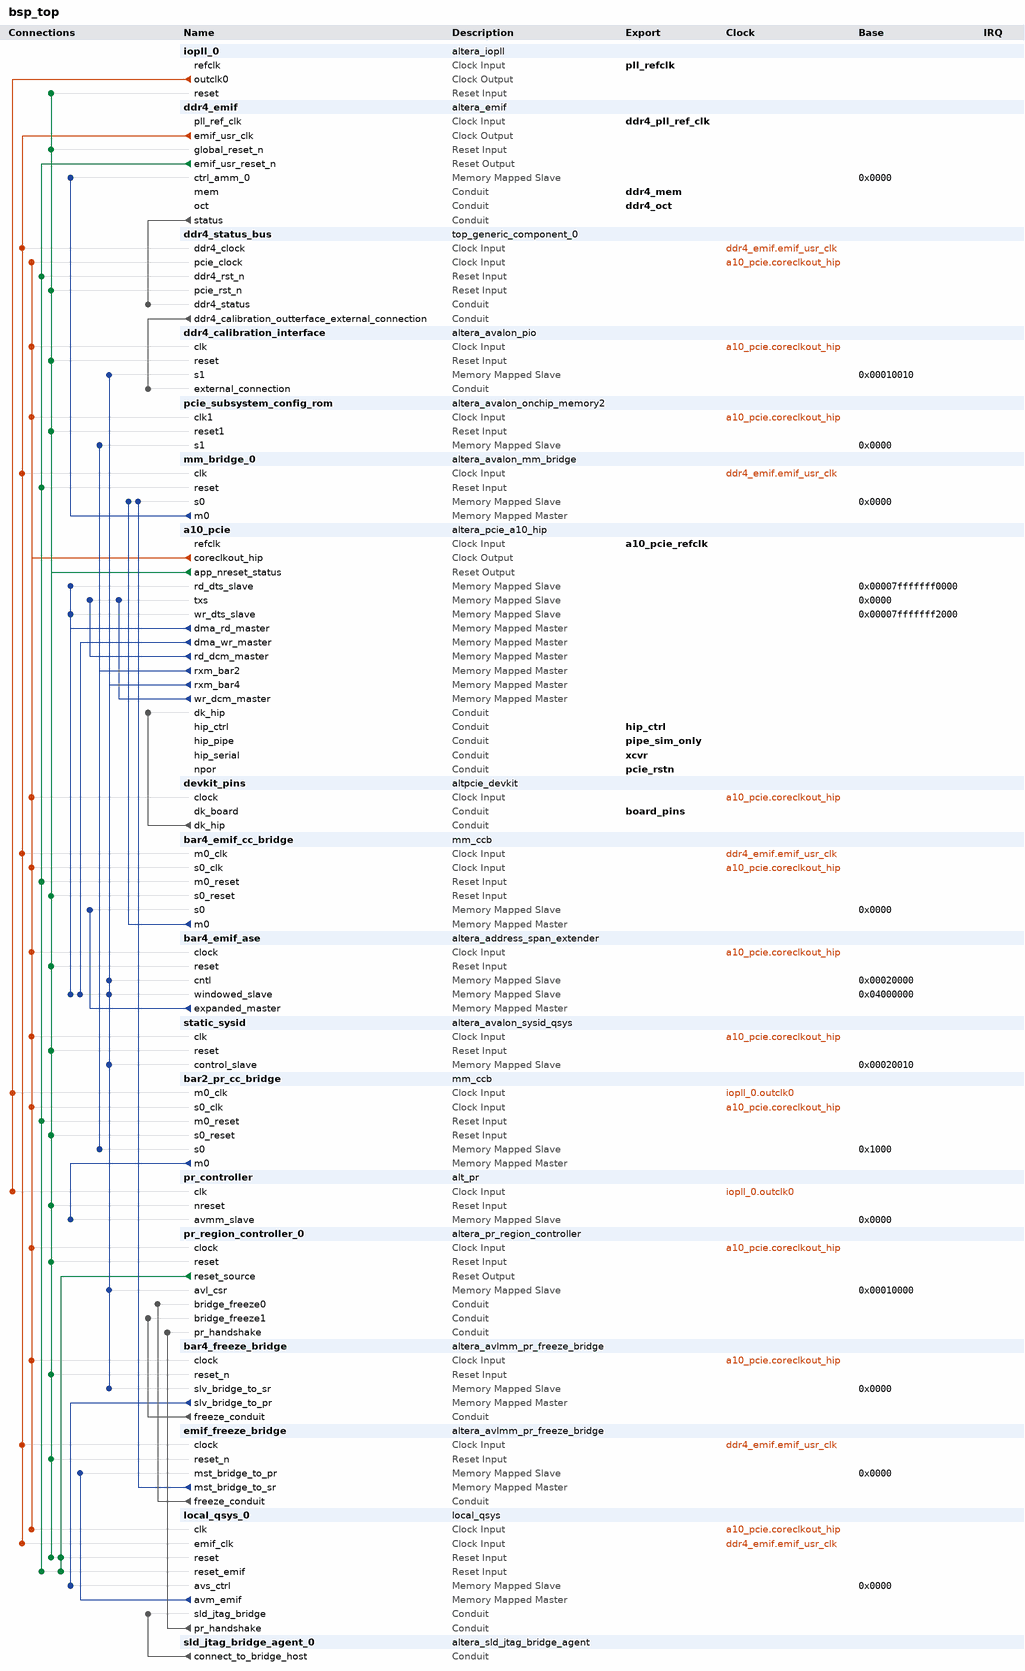
[diagram p0: system contents]
# Platform Designer (Qsys) system bsp_top, Arria 10 10AX115S2F45I1SG
# Parameters at their usual value, and those the tool derives, are not listed.
package require -exact qsys 1.0
create_system bsp_top
set_project_property DEVICE_FAMILY {Arria 10}
set_project_property DEVICE 10AX115S2F45I1SG

add_component iopll_0 ip/bsp_top/bsp_top_iopll_0.ip altera_iopll iopll_0 19.3.1

add_component ddr4_emif ip/bsp_top/ddr4_emif.ip altera_emif ddr4_emif 19.2.0

add_component ddr4_status_bus {} top_generic_component_0 ddr4_status_bus 1.0

add_component ddr4_calibration_interface ip/design_top/ddr4_calibration_pio.ip altera_avalon_pio ddr4_calibration_interface 19.1.2

add_component pcie_subsystem_config_rom ip/design_top/avalon_system_config.ip altera_avalon_onchip_memory2 pcie_subsystem_config_rom 19.2.1

add_component mm_bridge_0 ip/bsp_top/bsp_top_mm_bridge_0.ip altera_avalon_mm_bridge mm_bridge_0 20.0.1

add_component a10_pcie ip/bsp_top/top_a10_pcie.ip altera_pcie_a10_hip a10_pcie 20.1.0

add_component devkit_pins ip/bsp_top/top_dk.ip altpcie_devkit devkit_pins 19.1
load_component devkit_pins
save_component

add_component bar4_emif_cc_bridge ip/bsp_top/bsp_top_mm_clock_crossing_bridge_0.ip mm_ccb bar4_emif_cc_bridge 19.2.0
load_component bar4_emif_cc_bridge
set_component_parameter_value DATA_WIDTH 64
set_component_parameter_value SYMBOL_WIDTH 8
set_component_parameter_value ADDRESS_WIDTH 31
set_component_parameter_value USE_AUTO_ADDRESS_WIDTH 0
set_component_parameter_value ADDRESS_UNITS SYMBOLS
set_component_parameter_value MAX_BURST_SIZE 4
set_component_parameter_value COMMAND_FIFO_DEPTH 2
set_component_parameter_value RESPONSE_FIFO_DEPTH 8
set_component_parameter_value MASTER_SYNC_DEPTH 2
set_component_parameter_value SLAVE_SYNC_DEPTH 2
set_component_parameter_value SYNC_RESET 0
save_component

add_component bar4_emif_ase ip/bsp_top/bsp_top_address_span_extender_0.ip altera_address_span_extender bar4_emif_ase 19.2.0

add_component static_sysid ip/bsp_top/bsp_top_sysid_qsys_0.ip altera_avalon_sysid_qsys static_sysid 19.1.1
load_component static_sysid
set_component_parameter_value id -1091633149
set_component_parameter_value TIMESTAMP 0
save_component

add_component bar2_pr_cc_bridge ip/bsp_top/bsp_top_mm_clock_crossing_bridge_1.ip mm_ccb bar2_pr_cc_bridge 19.2.0

add_component pr_controller ip/bsp_top/bsp_top_alt_pr_0.ip alt_pr pr_controller 19.1.0
load_component pr_controller
set_component_parameter_value PR_INTERNAL_HOST true
set_component_parameter_value ENABLE_JTAG false
set_component_parameter_value ENABLE_AVMM_SLAVE true
set_component_parameter_value ENABLE_INTERRUPT false
set_component_parameter_value ENABLE_FREEZE false
set_component_parameter_value ENABLE_HPR_UI false
set_component_parameter_value ENABLE_PRPOF_ID_CHECK_UI false
set_component_parameter_value EXT_HOST_PRPOF_ID 0
set_component_parameter_value EXT_HOST_TARGET_DEVICE_FAMILY {Arria 10}
set_component_parameter_value DATA_WIDTH_INDEX 32
set_component_parameter_value CDRATIO 1
set_component_parameter_value EDCRC_OSC_DIVIDER 1
set_component_parameter_value ENABLE_ENHANCED_DECOMPRESSION false
set_component_parameter_value INSTANTIATE_PR_BLOCK true
set_component_parameter_value INSTANTIATE_CRC_BLOCK true
set_component_parameter_value GENERATE_SDC true
save_component

add_component pr_region_controller_0 ip/bsp_top/bsp_top_pr_region_controller_0.ip altera_pr_region_controller pr_region_controller_0 19.1.1
load_component pr_region_controller_0
set_component_parameter_value ENABLE_CSR true
set_component_parameter_value ENABLE_IRQ false
set_component_parameter_value NUM_INTF_BRIDGE 2
set_component_parameter_value ENABLE_PR_REGION_FREEZE false
set_component_parameter_value NUM_PR_REGION_RAM 1
save_component

add_component bar4_freeze_bridge ip/bsp_top/bsp_top_avlmm_pr_freeze_bridge_0.ip altera_avlmm_pr_freeze_bridge bar4_freeze_bridge 19.1.1

add_component emif_freeze_bridge ip/bsp_top/bsp_top_avlmm_pr_freeze_bridge_1.ip altera_avlmm_pr_freeze_bridge emif_freeze_bridge 19.1.1

add_component local_qsys_0 /home/user/projects/A10_PR/fpga-partial-reconfig-master/ref_designs/Q21.1_a10_pcie_devkit_pr64/source/basic_hls2_persona/local_qsys.qsys local_qsys local_qsys_0 

add_component sld_jtag_bridge_agent_0 ip/bsp_top/bsp_top_sld_jtag_bridge_agent_0.ip altera_sld_jtag_bridge_agent sld_jtag_bridge_agent_0 19.2.0

# connections
add_connection a10_pcie.coreclkout_hip bar2_pr_cc_bridge.s0_clk clock
add_connection a10_pcie.coreclkout_hip bar4_emif_ase.clock clock
add_connection a10_pcie.coreclkout_hip bar4_emif_cc_bridge.s0_clk clock
add_connection a10_pcie.coreclkout_hip bar4_freeze_bridge.clock clock
add_connection a10_pcie.coreclkout_hip ddr4_calibration_interface.clk clock
add_connection a10_pcie.coreclkout_hip ddr4_status_bus.pcie_clock clock
add_connection a10_pcie.coreclkout_hip devkit_pins.clock clock
add_connection a10_pcie.coreclkout_hip local_qsys_0.clk clock
add_connection a10_pcie.coreclkout_hip pcie_subsystem_config_rom.clk1 clock
add_connection a10_pcie.coreclkout_hip pr_region_controller_0.clock clock
add_connection a10_pcie.coreclkout_hip static_sysid.clk clock
add_connection ddr4_emif.emif_usr_clk bar4_emif_cc_bridge.m0_clk clock
add_connection ddr4_emif.emif_usr_clk ddr4_status_bus.ddr4_clock clock
add_connection ddr4_emif.emif_usr_clk emif_freeze_bridge.clock clock
add_connection ddr4_emif.emif_usr_clk local_qsys_0.emif_clk clock
add_connection ddr4_emif.emif_usr_clk mm_bridge_0.clk clock
add_connection iopll_0.outclk0 bar2_pr_cc_bridge.m0_clk clock
add_connection iopll_0.outclk0 pr_controller.clk clock
add_connection a10_pcie.app_nreset_status bar2_pr_cc_bridge.s0_reset reset
add_connection a10_pcie.app_nreset_status bar4_emif_ase.reset reset
add_connection a10_pcie.app_nreset_status bar4_emif_cc_bridge.s0_reset reset
add_connection a10_pcie.app_nreset_status bar4_freeze_bridge.reset_n reset
add_connection a10_pcie.app_nreset_status ddr4_calibration_interface.reset reset
add_connection a10_pcie.app_nreset_status ddr4_emif.global_reset_n reset
add_connection a10_pcie.app_nreset_status ddr4_status_bus.pcie_rst_n reset
add_connection a10_pcie.app_nreset_status emif_freeze_bridge.reset_n reset
add_connection a10_pcie.app_nreset_status iopll_0.reset reset
add_connection a10_pcie.app_nreset_status local_qsys_0.reset reset
add_connection a10_pcie.app_nreset_status pcie_subsystem_config_rom.reset1 reset
add_connection a10_pcie.app_nreset_status pr_controller.nreset reset
add_connection a10_pcie.app_nreset_status pr_region_controller_0.reset reset
add_connection a10_pcie.app_nreset_status static_sysid.reset reset
add_connection ddr4_emif.emif_usr_reset_n bar2_pr_cc_bridge.m0_reset reset
add_connection ddr4_emif.emif_usr_reset_n bar4_emif_cc_bridge.m0_reset reset
add_connection ddr4_emif.emif_usr_reset_n ddr4_status_bus.ddr4_rst_n reset
add_connection ddr4_emif.emif_usr_reset_n local_qsys_0.reset_emif reset
add_connection ddr4_emif.emif_usr_reset_n mm_bridge_0.reset reset
add_connection pr_region_controller_0.reset_source local_qsys_0.reset reset
add_connection pr_region_controller_0.reset_source local_qsys_0.reset_emif reset
add_connection a10_pcie.dma_rd_master a10_pcie.rd_dts_slave avalon
set_connection_parameter_value a10_pcie.dma_rd_master/a10_pcie.rd_dts_slave baseAddress 0x00007fffffff0000
add_connection a10_pcie.dma_rd_master a10_pcie.wr_dts_slave avalon
set_connection_parameter_value a10_pcie.dma_rd_master/a10_pcie.wr_dts_slave baseAddress 0x00007fffffff2000
add_connection a10_pcie.dma_rd_master bar4_emif_ase.windowed_slave avalon
set_connection_parameter_value a10_pcie.dma_rd_master/bar4_emif_ase.windowed_slave baseAddress 0x04000000
add_connection a10_pcie.dma_wr_master bar4_emif_ase.windowed_slave avalon
set_connection_parameter_value a10_pcie.dma_wr_master/bar4_emif_ase.windowed_slave baseAddress 0x04000000
add_connection a10_pcie.rd_dcm_master a10_pcie.txs avalon
set_connection_parameter_value a10_pcie.rd_dcm_master/a10_pcie.txs baseAddress 0x0000
add_connection a10_pcie.rxm_bar2 bar2_pr_cc_bridge.s0 avalon
set_connection_parameter_value a10_pcie.rxm_bar2/bar2_pr_cc_bridge.s0 baseAddress 0x1000
add_connection a10_pcie.rxm_bar2 pcie_subsystem_config_rom.s1 avalon
set_connection_parameter_value a10_pcie.rxm_bar2/pcie_subsystem_config_rom.s1 baseAddress 0x0000
add_connection a10_pcie.rxm_bar4 bar4_emif_ase.cntl avalon
set_connection_parameter_value a10_pcie.rxm_bar4/bar4_emif_ase.cntl baseAddress 0x00020000
add_connection a10_pcie.rxm_bar4 bar4_emif_ase.windowed_slave avalon
set_connection_parameter_value a10_pcie.rxm_bar4/bar4_emif_ase.windowed_slave baseAddress 0x04000000
add_connection a10_pcie.rxm_bar4 bar4_freeze_bridge.slv_bridge_to_sr avalon
set_connection_parameter_value a10_pcie.rxm_bar4/bar4_freeze_bridge.slv_bridge_to_sr baseAddress 0x0000
add_connection a10_pcie.rxm_bar4 ddr4_calibration_interface.s1 avalon
set_connection_parameter_value a10_pcie.rxm_bar4/ddr4_calibration_interface.s1 baseAddress 0x00010010
add_connection a10_pcie.rxm_bar4 pr_region_controller_0.avl_csr avalon
set_connection_parameter_value a10_pcie.rxm_bar4/pr_region_controller_0.avl_csr baseAddress 0x00010000
add_connection a10_pcie.rxm_bar4 static_sysid.control_slave avalon
set_connection_parameter_value a10_pcie.rxm_bar4/static_sysid.control_slave baseAddress 0x00020010
add_connection a10_pcie.wr_dcm_master a10_pcie.txs avalon
set_connection_parameter_value a10_pcie.wr_dcm_master/a10_pcie.txs baseAddress 0x0000
add_connection bar2_pr_cc_bridge.m0 pr_controller.avmm_slave avalon
set_connection_parameter_value bar2_pr_cc_bridge.m0/pr_controller.avmm_slave baseAddress 0x0000
add_connection bar4_emif_ase.expanded_master bar4_emif_cc_bridge.s0 avalon
set_connection_parameter_value bar4_emif_ase.expanded_master/bar4_emif_cc_bridge.s0 baseAddress 0x0000
add_connection bar4_emif_cc_bridge.m0 mm_bridge_0.s0 avalon
set_connection_parameter_value bar4_emif_cc_bridge.m0/mm_bridge_0.s0 baseAddress 0x0000
add_connection bar4_freeze_bridge.slv_bridge_to_pr local_qsys_0.avs_ctrl avalon
set_connection_parameter_value bar4_freeze_bridge.slv_bridge_to_pr/local_qsys_0.avs_ctrl baseAddress 0x0000
add_connection emif_freeze_bridge.mst_bridge_to_sr mm_bridge_0.s0 avalon
set_connection_parameter_value emif_freeze_bridge.mst_bridge_to_sr/mm_bridge_0.s0 baseAddress 0x0000
add_connection local_qsys_0.avm_emif emif_freeze_bridge.mst_bridge_to_pr avalon
set_connection_parameter_value local_qsys_0.avm_emif/emif_freeze_bridge.mst_bridge_to_pr baseAddress 0x0000
add_connection mm_bridge_0.m0 ddr4_emif.ctrl_amm_0 avalon
set_connection_parameter_value mm_bridge_0.m0/ddr4_emif.ctrl_amm_0 baseAddress 0x0000
add_connection bar4_freeze_bridge.freeze_conduit pr_region_controller_0.bridge_freeze1 conduit
add_connection ddr4_emif.status ddr4_status_bus.ddr4_status conduit
add_connection ddr4_status_bus.ddr4_calibration_outterface_external_connection ddr4_calibration_interface.external_connection conduit
add_connection devkit_pins.dk_hip a10_pcie.dk_hip conduit
add_connection emif_freeze_bridge.freeze_conduit pr_region_controller_0.bridge_freeze0 conduit
add_connection local_qsys_0.pr_handshake pr_region_controller_0.pr_handshake conduit
add_connection sld_jtag_bridge_agent_0.connect_to_bridge_host local_qsys_0.sld_jtag_bridge conduit

# exported interfaces
add_interface a10_pcie_refclk clock sink
set_interface_property a10_pcie_refclk EXPORT_OF a10_pcie.refclk
add_interface board_pins conduit end
set_interface_property board_pins EXPORT_OF devkit_pins.dk_board
add_interface ddr4_mem conduit end
set_interface_property ddr4_mem EXPORT_OF ddr4_emif.mem
add_interface ddr4_oct conduit end
set_interface_property ddr4_oct EXPORT_OF ddr4_emif.oct
add_interface ddr4_pll_ref_clk clock sink
set_interface_property ddr4_pll_ref_clk EXPORT_OF ddr4_emif.pll_ref_clk
add_interface hip_ctrl conduit end
set_interface_property hip_ctrl EXPORT_OF a10_pcie.hip_ctrl
add_interface pcie_rstn conduit end
set_interface_property pcie_rstn EXPORT_OF a10_pcie.npor
add_interface pipe_sim_only conduit end
set_interface_property pipe_sim_only EXPORT_OF a10_pcie.hip_pipe
add_interface pll_refclk clock sink
set_interface_property pll_refclk EXPORT_OF iopll_0.refclk
add_interface xcvr conduit end
set_interface_property xcvr EXPORT_OF a10_pcie.hip_serial

save_system bsp_top.qsys
